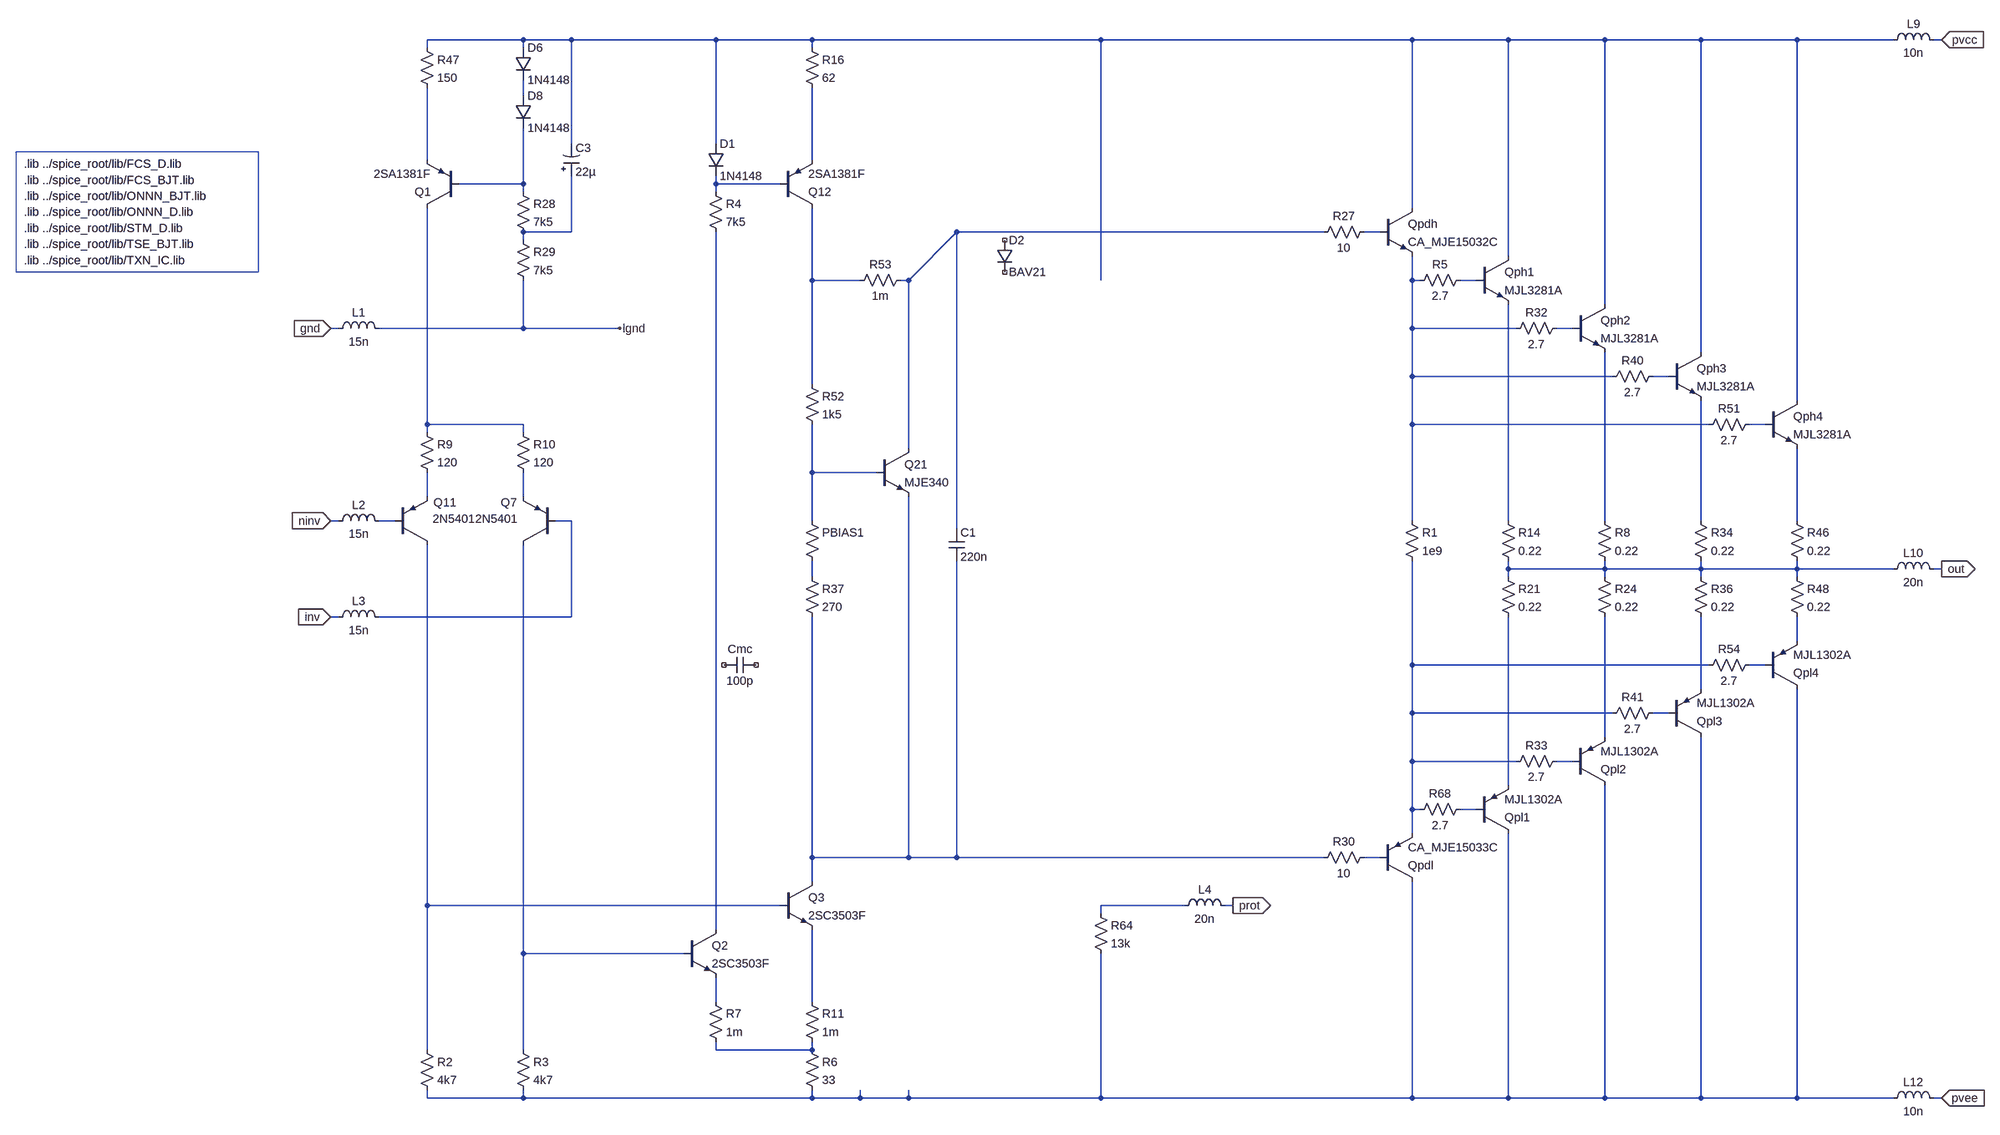
[diagram p0: schematic pab3bbb-arguo-module-ds.asc]
pab3bbb-arguo-module-ds.asc, the LTspice schematic file:
Version 4
SHEET 1 6124 2336
WIRE -192 -1280 -384 -1280
WIRE -96 -1280 -192 -1280
WIRE 192 -1280 -96 -1280
WIRE 384 -1280 192 -1280
WIRE 960 -1280 384 -1280
WIRE 1632 -1280 960 -1280
WIRE 1824 -1280 1632 -1280
WIRE 2016 -1280 1824 -1280
WIRE 2208 -1280 2016 -1280
WIRE 2400 -1280 2208 -1280
WIRE 2592 -1280 2400 -1280
WIRE 2688 -1280 2672 -1280
WIRE -384 -1264 -384 -1280
WIRE -192 -1264 -192 -1280
WIRE 384 -1264 384 -1280
WIRE -192 -1168 -192 -1200
WIRE -96 -1072 -96 -1280
WIRE 192 -1072 192 -1280
WIRE -384 -1040 -384 -1184
WIRE 384 -1040 384 -1184
WIRE -192 -992 -192 -1104
WIRE -192 -992 -320 -992
WIRE 192 -992 192 -1008
WIRE 320 -992 192 -992
WIRE -192 -976 -192 -992
WIRE 192 -976 192 -992
WIRE 1632 -944 1632 -1280
WIRE -96 -896 -96 -1008
WIRE -96 -896 -192 -896
WIRE 1456 -896 672 -896
WIRE 1568 -896 1536 -896
WIRE -192 -880 -192 -896
WIRE 1824 -848 1824 -1280
WIRE 384 -800 384 -944
WIRE 480 -800 384 -800
WIRE 576 -800 672 -896
WIRE 576 -800 560 -800
WIRE 960 -800 960 -1280
WIRE 1632 -800 1632 -848
WIRE 1648 -800 1632 -800
WIRE 1760 -800 1728 -800
WIRE 2016 -752 2016 -1280
WIRE -560 -704 -576 -704
WIRE -192 -704 -192 -800
WIRE -192 -704 -480 -704
WIRE 0 -704 -192 -704
WIRE 1632 -704 1632 -800
WIRE 1840 -704 1632 -704
WIRE 1952 -704 1920 -704
WIRE 2208 -656 2208 -1280
WIRE 1632 -608 1632 -704
WIRE 2032 -608 1632 -608
WIRE 2144 -608 2112 -608
WIRE 384 -592 384 -800
WIRE 2400 -560 2400 -1280
WIRE -384 -512 -384 -944
WIRE -192 -512 -384 -512
WIRE 1632 -512 1632 -608
WIRE 2224 -512 1632 -512
WIRE 2336 -512 2304 -512
WIRE -384 -496 -384 -512
WIRE -192 -496 -192 -512
WIRE 576 -464 576 -800
WIRE 384 -416 384 -512
WIRE 512 -416 384 -416
WIRE -384 -368 -384 -416
WIRE -192 -368 -192 -416
WIRE -560 -320 -576 -320
WIRE -448 -320 -480 -320
WIRE -96 -320 -128 -320
WIRE 384 -320 384 -416
WIRE 1632 -320 1632 -512
WIRE 1824 -320 1824 -752
WIRE 2016 -320 2016 -656
WIRE 2208 -320 2208 -560
WIRE 2400 -320 2400 -464
WIRE 672 -304 672 -896
WIRE 1824 -224 1824 -240
WIRE 2016 -224 2016 -240
WIRE 2016 -224 1824 -224
WIRE 2208 -224 2208 -240
WIRE 2208 -224 2016 -224
WIRE 2400 -224 2400 -240
WIRE 2400 -224 2208 -224
WIRE 2592 -224 2400 -224
WIRE 2688 -224 2672 -224
WIRE 384 -208 384 -240
WIRE 1824 -208 1824 -224
WIRE 2016 -208 2016 -224
WIRE 2208 -208 2208 -224
WIRE 2400 -208 2400 -224
WIRE -560 -128 -576 -128
WIRE -96 -128 -96 -320
WIRE -96 -128 -480 -128
WIRE 2400 -80 2400 -128
WIRE 1632 -32 1632 -240
WIRE 2224 -32 1632 -32
WIRE 2336 -32 2304 -32
WIRE 2208 16 2208 -128
WIRE 1632 64 1632 -32
WIRE 2032 64 1632 64
WIRE 2144 64 2112 64
WIRE 2016 112 2016 -128
WIRE 1632 160 1632 64
WIRE 1840 160 1632 160
WIRE 1952 160 1920 160
WIRE 1824 208 1824 -128
WIRE 1632 256 1632 160
WIRE 1648 256 1632 256
WIRE 1760 256 1728 256
WIRE 1632 304 1632 256
WIRE 384 352 384 -128
WIRE 576 352 576 -368
WIRE 576 352 384 352
WIRE 672 352 672 -240
WIRE 672 352 576 352
WIRE 1456 352 672 352
WIRE 1568 352 1536 352
WIRE 384 400 384 352
WIRE -384 448 -384 -272
WIRE 320 448 -384 448
WIRE 1152 448 960 448
WIRE 1248 448 1232 448
WIRE 960 464 960 448
WIRE 192 496 192 -896
WIRE -192 544 -192 -272
WIRE 128 544 -192 544
WIRE 192 640 192 592
WIRE 384 640 384 496
WIRE -384 736 -384 448
WIRE -192 736 -192 544
WIRE 192 736 192 720
WIRE 384 736 384 720
WIRE 384 736 192 736
WIRE -384 832 -384 816
WIRE -192 832 -192 816
WIRE -192 832 -384 832
WIRE 384 832 384 816
WIRE 384 832 -192 832
WIRE 480 832 480 816
WIRE 480 832 384 832
WIRE 576 832 576 816
WIRE 576 832 480 832
WIRE 960 832 960 544
WIRE 960 832 576 832
WIRE 1632 832 1632 400
WIRE 1632 832 960 832
WIRE 1824 832 1824 304
WIRE 1824 832 1632 832
WIRE 2016 832 2016 208
WIRE 2016 832 1824 832
WIRE 2208 832 2208 112
WIRE 2208 832 2016 832
WIRE 2400 832 2400 16
WIRE 2400 832 2208 832
WIRE 2592 832 2400 832
WIRE 2688 832 2672 832
FLAG 2688 -1280 pvcc
IOPIN 2688 -1280 In
FLAG 2688 832 pvee
IOPIN 2688 832 In
FLAG 2688 -224 out
IOPIN 2688 -224 Out
FLAG -576 -320 ninv
IOPIN -576 -320 In
FLAG -576 -128 inv
IOPIN -576 -128 In
FLAG -576 -704 gnd
IOPIN -576 -704 In
FLAG 0 -704 lgnd
FLAG 1248 448 prot
IOPIN 1248 448 Out
SYMBOL pnp -448 -272 M180
WINDOW 0 77 84 Left 2
WINDOW 3 75 52 Left 2
SYMATTR InstName Q11
SYMATTR Value 2N5401
SYMBOL res -400 720 R0
SYMATTR InstName R2
SYMATTR Value 4k7
SYMBOL res -208 720 R0
SYMATTR InstName R3
SYMATTR Value 4k7
SYMBOL res -400 -512 R0
SYMATTR InstName R9
SYMATTR Value 120
SYMBOL res -208 -512 R0
SYMATTR InstName R10
SYMATTR Value 120
SYMBOL res 368 -1280 R0
SYMATTR InstName R16
SYMATTR Value 62
SYMBOL pnp 320 -944 M180
SYMATTR InstName Q12
SYMATTR Value 2SA1381F
SYMBOL res 1552 -912 R90
WINDOW 0 0 56 VBottom 2
WINDOW 3 32 56 VTop 2
SYMATTR InstName R27
SYMATTR Value 10
SYMBOL res 1552 336 R90
WINDOW 0 0 56 VBottom 2
WINDOW 3 32 56 VTop 2
SYMATTR InstName R30
SYMATTR Value 10
SYMBOL res -400 -1280 R0
SYMATTR InstName R47
SYMATTR Value 150
SYMBOL res 368 -336 R0
WINDOW 3 36 76 Invisible 2
SYMATTR Value {1+(500*BIAS)}
SYMATTR InstName PBIAS1
SYMBOL res 368 -608 R0
SYMATTR InstName R52
SYMATTR Value 1k5
SYMBOL res 576 -816 R90
WINDOW 0 0 56 VBottom 2
WINDOW 3 32 56 VTop 2
SYMATTR InstName R53
SYMATTR Value 1m
SYMBOL npn 320 400 R0
SYMATTR InstName Q3
SYMATTR Value 2SC3503F
SYMBOL res 368 720 R0
SYMATTR InstName R6
SYMATTR Value 33
SYMBOL res 176 -992 R0
SYMATTR InstName R4
SYMATTR Value 7k5
SYMBOL pnp -320 -944 R180
SYMATTR InstName Q1
SYMATTR Value 2SA1381F
SYMBOL pnp -128 -272 R180
WINDOW 0 77 84 Left 2
WINDOW 3 75 52 Left 2
SYMATTR InstName Q7
SYMATTR Value 2N5401
SYMBOL npn 512 -464 R0
SYMATTR InstName Q21
SYMATTR Value MJE340
SYMBOL res 368 -224 R0
SYMATTR InstName R37
SYMATTR Value 270
SYMBOL npn 1760 -848 R0
SYMATTR InstName Qph1
SYMATTR Value MJL3281A
SYMBOL pnp 1760 304 M180
SYMATTR InstName Qpl1
SYMATTR Value MJL1302A
SYMBOL res 1744 -816 R90
WINDOW 0 0 56 VBottom 2
WINDOW 3 32 56 VTop 2
SYMATTR InstName R5
SYMATTR Value 2.7
SYMBOL res 1744 240 R90
WINDOW 0 0 56 VBottom 2
WINDOW 3 32 56 VTop 2
SYMATTR InstName R68
SYMATTR Value 2.7
SYMBOL cap 272 -48 R90
WINDOW 0 0 32 VBottom 2
WINDOW 3 32 32 VTop 2
SYMATTR InstName Cmc
SYMATTR Value 100p
SYMATTR SpiceLine V=100 Irms=20.8m Rser=5.448 Lser=3n Rpar=6.4meg Cpar=1p
SYMBOL res 1808 -336 R0
SYMATTR InstName R14
SYMATTR Value 0.22
SYMBOL res 1808 -224 R0
SYMATTR InstName R21
SYMATTR Value 0.22
SYMBOL cap 656 -240 M180
WINDOW 0 24 56 Left 2
WINDOW 3 24 8 Left 2
SYMATTR InstName C1
SYMATTR Value 220n
SYMATTR SpiceLine V=25 Irms=1.76 Rser=0.057522 Lser=3n Rpar=4.4meg Cpar=1p
SYMBOL ind -576 -688 R270
WINDOW 0 32 56 VTop 2
WINDOW 3 5 56 VBottom 2
SYMATTR InstName L1
SYMATTR Value 15n
SYMATTR SpiceLine Rser=20m
SYMBOL ind -576 -304 R270
WINDOW 0 32 56 VTop 2
WINDOW 3 5 56 VBottom 2
SYMATTR InstName L2
SYMATTR Value 15n
SYMATTR SpiceLine Rser=20m
SYMBOL ind -576 -112 R270
WINDOW 0 32 56 VTop 2
WINDOW 3 5 56 VBottom 2
SYMATTR InstName L3
SYMATTR Value 15n
SYMATTR SpiceLine Rser=20m
SYMBOL ind 2576 -208 R270
WINDOW 0 32 56 VTop 2
WINDOW 3 5 56 VBottom 2
SYMATTR InstName L10
SYMATTR Value 20n
SYMATTR SpiceLine Rser=10m
SYMBOL ind 2576 -1264 R270
WINDOW 0 32 56 VTop 2
WINDOW 3 5 56 VBottom 2
SYMATTR InstName L9
SYMATTR Value 10n
SYMATTR SpiceLine Rser=10m
SYMBOL ind 2576 848 R270
WINDOW 0 32 56 VTop 2
WINDOW 3 5 56 VBottom 2
SYMATTR InstName L12
SYMATTR Value 10n
SYMATTR SpiceLine Rser=10m
SYMBOL npn 1568 -944 R0
SYMATTR InstName Qpdh
SYMATTR Value CA_MJE15032C
SYMBOL pnp 1568 400 M180
SYMATTR InstName Qpdl
SYMATTR Value CA_MJE15033C
SYMBOL res 1616 -336 R0
SYMATTR InstName R1
SYMATTR Value 1e9
SYMBOL res 2000 -336 R0
SYMATTR InstName R8
SYMATTR Value 0.22
SYMBOL res 2000 -224 R0
SYMATTR InstName R24
SYMATTR Value 0.22
SYMBOL npn 1952 -752 R0
SYMATTR InstName Qph2
SYMATTR Value MJL3281A
SYMBOL res 1936 -720 R90
WINDOW 0 0 56 VBottom 2
WINDOW 3 32 56 VTop 2
SYMATTR InstName R32
SYMATTR Value 2.7
SYMBOL pnp 1952 208 M180
SYMATTR InstName Qpl2
SYMATTR Value MJL1302A
SYMBOL res 1936 144 R90
WINDOW 0 0 56 VBottom 2
WINDOW 3 32 56 VTop 2
SYMATTR InstName R33
SYMATTR Value 2.7
SYMBOL res 2192 -336 R0
SYMATTR InstName R34
SYMATTR Value 0.22
SYMBOL res 2192 -224 R0
SYMATTR InstName R36
SYMATTR Value 0.22
SYMBOL res 2128 -624 R90
WINDOW 0 0 56 VBottom 2
WINDOW 3 32 56 VTop 2
SYMATTR InstName R40
SYMATTR Value 2.7
SYMBOL res 2128 48 R90
WINDOW 0 0 56 VBottom 2
WINDOW 3 32 56 VTop 2
SYMATTR InstName R41
SYMATTR Value 2.7
SYMBOL res 2384 -336 R0
SYMATTR InstName R46
SYMATTR Value 0.22
SYMBOL res 2384 -224 R0
SYMATTR InstName R48
SYMATTR Value 0.22
SYMBOL res 2320 -528 R90
WINDOW 0 0 56 VBottom 2
WINDOW 3 32 56 VTop 2
SYMATTR InstName R51
SYMATTR Value 2.7
SYMBOL res 2320 -48 R90
WINDOW 0 0 56 VBottom 2
WINDOW 3 32 56 VTop 2
SYMATTR InstName R54
SYMATTR Value 2.7
SYMBOL ind 1136 464 R270
WINDOW 0 32 56 VTop 2
WINDOW 3 5 56 VBottom 2
SYMATTR InstName L4
SYMATTR Value 20n
SYMATTR SpiceLine Rser=10m
SYMBOL diode 752 -880 R0
SYMATTR InstName D2
SYMATTR Value BAV21
SYMBOL res 944 448 R0
SYMATTR InstName R64
SYMATTR Value 13k
SYMBOL polcap -112 -1008 M180
WINDOW 0 24 56 Left 2
WINDOW 3 24 8 Left 2
SYMATTR InstName C3
SYMATTR Value 22µ
SYMATTR SpiceLine V=35 Irms=65m Rser=2.3 Lser=0 Rpar=700k Cpar=1p mfg="Nichicon" pn="UPR1V220MAH" type="Al electrolytic"
SYMATTR Description Capacitor
SYMATTR Type cap
SYMBOL res -208 -992 R0
SYMATTR InstName R28
SYMATTR Value 7k5
SYMBOL res -208 -896 R0
SYMATTR InstName R29
SYMATTR Value 7k5
SYMBOL diode -208 -1264 R0
SYMATTR InstName D6
SYMATTR Value 1N4148
SYMBOL diode -208 -1168 R0
SYMATTR InstName D8
SYMATTR Value 1N4148
SYMBOL pnp 2144 112 M180
SYMATTR InstName Qpl3
SYMATTR Value MJL1302A
SYMBOL npn 2144 -656 R0
SYMATTR InstName Qph3
SYMATTR Value MJL3281A
SYMBOL npn 2336 -560 R0
SYMATTR InstName Qph4
SYMATTR Value MJL3281A
SYMBOL pnp 2336 16 M180
SYMATTR InstName Qpl4
SYMATTR Value MJL1302A
SYMBOL npn 128 496 R0
SYMATTR InstName Q2
SYMATTR Value 2SC3503F
SYMBOL diode 176 -1072 R0
SYMATTR InstName D1
SYMATTR Value 1N4148
SYMBOL res 176 624 R0
SYMATTR InstName R7
SYMATTR Value 1m
SYMBOL res 368 624 R0
SYMATTR InstName R11
SYMATTR Value 1m
TEXT -1376 -968 Left 2 !.lib ../spice_root/lib/ONNN_BJT.lib
TEXT -1376 -904 Left 2 !.lib ../spice_root/lib/STM_D.lib
TEXT -1376 -1000 Left 2 !.lib ../spice_root/lib/FCS_BJT.lib
TEXT -1376 -1032 Left 2 !.lib ../spice_root/lib/FCS_D.lib
TEXT -1376 -936 Left 2 !.lib ../spice_root/lib/ONNN_D.lib
TEXT -1376 -872 Left 2 !.lib ../spice_root/lib/TSE_BJT.lib
TEXT -1376 -840 Left 2 !.lib ../spice_root/lib/TXN_IC.lib
RECTANGLE Normal -720 -816 -1392 -1056

The netlist it stands for:
* pab3bbb-arguo-module-ds.asc
Q11 N039 N020 N018 0 2N5401
R2 N039 N046 4k7
R3 N042 N046 4k7
R9 N015 N018 120
R10 N015 N019 120
R16 N001 N004 62
Q12 N010 N006 N004 0 2SA1381F
R27 N009 N008 10
R30 N038 N037 10
R47 N001 N003 150
R§PBIAS1 N017 N027 {1+(500*BIAS)}
R52 N010 N017 1k5
R53 N008 N010 1m
Q3 N037 N039 N044 0 2SC3503F
R6 N045 N046 33
R4 N006 N041 7k5
Q1 N015 N005 N003 0 2SA1381F
Q7 N042 N021 N019 0 2N5401
Q21 N008 N017 N037 0 MJE340
R37 N027 N037 270
Qph1 N001 N012 N022 0 MJL3281A
Qpl1 N046 N036 N035 0 MJL1302A
R5 N012 N011 2.7
R68 N036 N029 2.7
Cmc NC_01 NC_02 100p V=100 Irms=20.8m Rser=5.448 Lser=3n Rpar=6.4meg Cpar=1p
R14 N022 N026 0.22
R21 N026 N035 0.22
C1 N037 N008 220n V=25 Irms=1.76 Rser=0.057522 Lser=3n Rpar=4.4meg Cpar=1p
L1 gnd lgnd 15n Rser=20m
L2 ninv N020 15n Rser=20m
L3 inv N021 15n Rser=20m
L10 N026 out 20n Rser=10m
L9 N001 pvcc 10n Rser=10m
L12 N046 pvee 10n Rser=10m
Qpdh N001 N009 N011 0 CA_MJE15032C
Qpdl N046 N038 N029 0 CA_MJE15033C
R1 N011 N029 1e9
R8 N023 N026 0.22
R24 N026 N033 0.22
Qph2 N001 N013 N023 0 MJL3281A
R32 N013 N011 2.7
Qpl2 N046 N034 N033 0 MJL1302A
R33 N034 N029 2.7
R34 N024 N026 0.22
R36 N026 N031 0.22
R40 N014 N011 2.7
R41 N032 N029 2.7
R46 N025 N026 0.22
R48 N026 N028 0.22
R51 N016 N011 2.7
R54 N030 N029 2.7
L4 N040 prot 20n Rser=10m
D2 NC_03 NC_04 BAV21
R64 N040 N046 13k
C3 N007 N001 22µ V=35 Irms=65m Rser=2.3 Lser=0 Rpar=700k Cpar=1p mfg="Nichicon" pn="UPR1V220MAH" type="Al electrolytic"
R28 N005 N007 7k5
R29 N007 lgnd 7k5
D6 N001 N002 1N4148
D8 N002 N005 1N4148
Qpl3 N046 N032 N031 0 MJL1302A
Qph3 N001 N014 N024 0 MJL3281A
Qph4 N001 N016 N025 0 MJL3281A
Qpl4 N046 N030 N028 0 MJL1302A
Q2 N041 N042 N043 0 2SC3503F
D1 N001 N006 1N4148
R7 N043 N045 1m
R11 N044 N045 1m
.model D D
.lib standard.dio
.model NPN NPN
.model PNP PNP
.lib standard.bjt
.lib ../spice_root/lib/ONNN_BJT.lib
.lib ../spice_root/lib/STM_D.lib
.lib ../spice_root/lib/FCS_BJT.lib
.lib ../spice_root/lib/FCS_D.lib
.lib ../spice_root/lib/ONNN_D.lib
.lib ../spice_root/lib/TSE_BJT.lib
.lib ../spice_root/lib/TXN_IC.lib
.backanno
.end